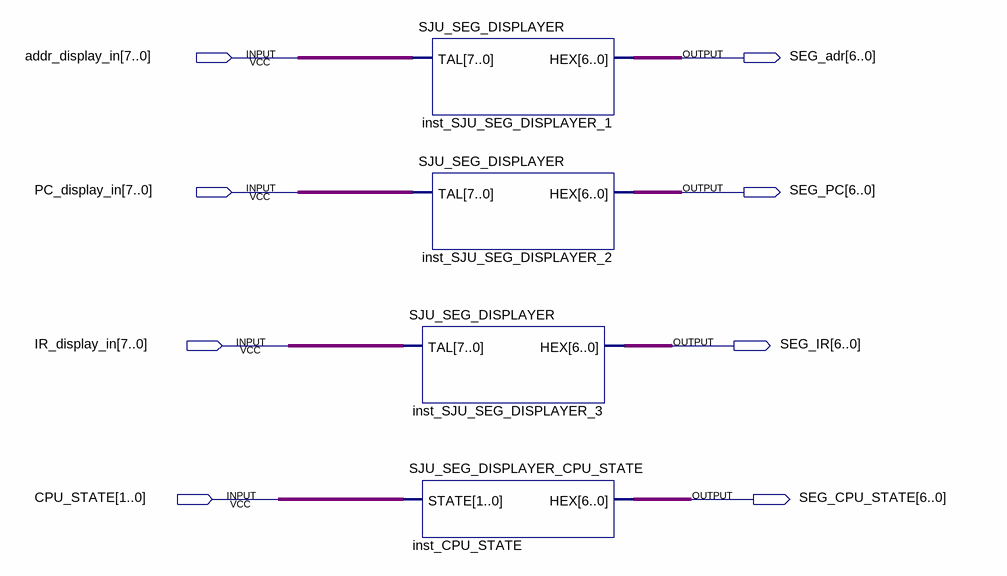
[diagram p0: schematic sheet]
// Quartus schematic STATUS_DISPLAY_SYSTEM.bdf as structural Verilog: 4 symbols, 8 pins
module STATUS_DISPLAY_SYSTEM (
  input  [7:0] addr_display_in,
  input  [7:0] PC_display_in,
  input  [7:0] IR_display_in,
  input  [1:0] CPU_STATE,
  output [6:0] SEG_adr,
  output [6:0] SEG_PC,
  output [6:0] SEG_IR,
  output [6:0] SEG_CPU_STATE
);

  SJU_SEG_DISPLAYER inst_SJU_SEG_DISPLAYER_1 (.TAL(addr_display_in), .HEX(SEG_adr));
  SJU_SEG_DISPLAYER inst_SJU_SEG_DISPLAYER_2 (.TAL(PC_display_in), .HEX(SEG_PC));
  SJU_SEG_DISPLAYER inst_SJU_SEG_DISPLAYER_3 (.TAL(IR_display_in), .HEX(SEG_IR));
  SJU_SEG_DISPLAYER_CPU_STATE inst_CPU_STATE (.STATE(CPU_STATE), .HEX(SEG_CPU_STATE));
endmodule
